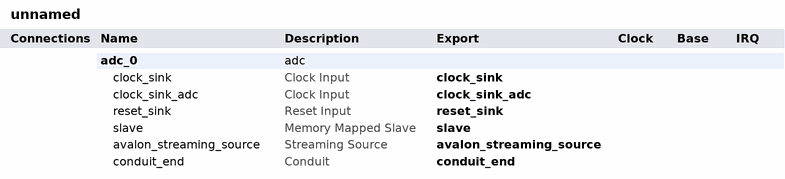
[diagram p0: system contents]
# Platform Designer (Qsys) system unnamed, Cyclone V 5CSEMA4U23C6
# Parameters at their usual value, and those the tool derives, are not listed.
package require qsys
create_system unnamed
set_project_property DEVICE_FAMILY {Cyclone V}
set_project_property DEVICE 5CSEMA4U23C6

add_instance adc_0 adc 1.0
set_instance_property adc_0 AUTO_EXPORT true

# exported interfaces
add_interface avalon_streaming_source avalon_streaming source
set_interface_property avalon_streaming_source EXPORT_OF adc_0.avalon_streaming_source
add_interface clock_sink clock sink
set_interface_property clock_sink EXPORT_OF adc_0.clock_sink
add_interface clock_sink_adc clock sink
set_interface_property clock_sink_adc EXPORT_OF adc_0.clock_sink_adc
add_interface conduit_end conduit end
set_interface_property conduit_end EXPORT_OF adc_0.conduit_end
add_interface reset_sink reset sink
set_interface_property reset_sink EXPORT_OF adc_0.reset_sink
add_interface slave avalon slave
set_interface_property slave EXPORT_OF adc_0.slave

set_interconnect_requirement {$system} qsys_mm.clockCrossingAdapter HANDSHAKE
set_interconnect_requirement {$system} qsys_mm.enableEccProtection FALSE
set_interconnect_requirement {$system} qsys_mm.insertDefaultSlave FALSE
set_interconnect_requirement {$system} qsys_mm.maxAdditionalLatency 1

save_system unnamed.qsys
